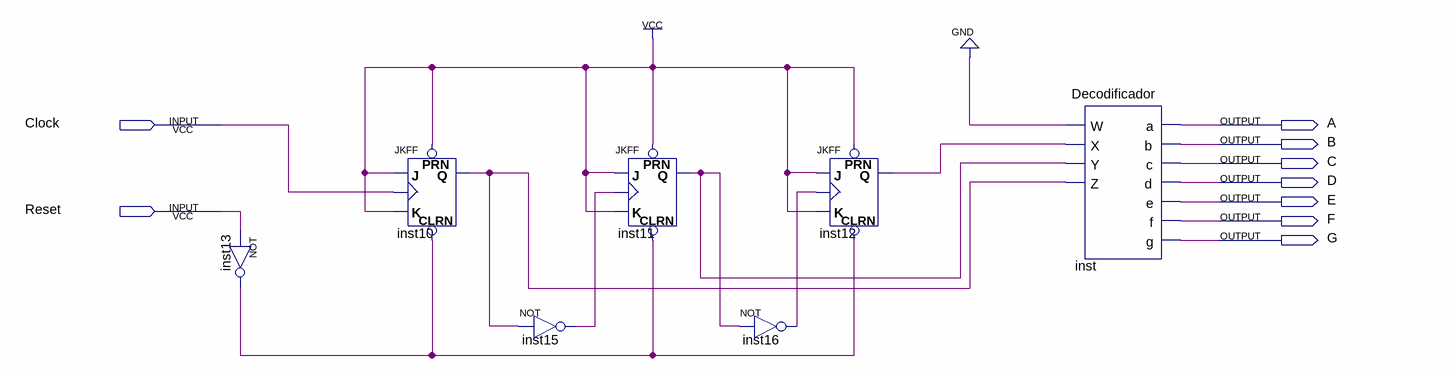
[diagram p0: schematic sheet]
// Quartus schematic ContAsyncAscDesc.bdf as structural Verilog: 7 symbols, 9 pins
module ContAsyncAscDesc (
  input  Clock,
  input  Reset,
  output A,
  output B,
  output C,
  output D,
  output E,
  output F,
  output G
);

  wire inst10_q, inst11_q, inst12_q, inst13_out, inst15_out, inst16_out;

  not inst13 (inst13_out, Reset);
  JKFF inst10 (.PRN(1'b1), .CLRN(inst13_out), .K(1'b1), .J(1'b1), .CLK(Clock), .Q(inst10_q));
  not inst15 (inst15_out, inst10_q);
  JKFF inst11 (.PRN(1'b1), .CLRN(inst13_out), .K(1'b1), .J(1'b1), .CLK(inst15_out), .Q(inst11_q));
  not inst16 (inst16_out, inst11_q);
  JKFF inst12 (.PRN(1'b1), .CLRN(inst13_out), .K(1'b1), .J(1'b1), .CLK(inst16_out), .Q(inst12_q));
  Decodificador inst (
    .W(1'b0), .X(inst12_q), .Y(inst11_q), .Z(inst10_q), .a(A), .b(B), .c(C), .d(D), .e(E), .f(F), .g(G));
endmodule
